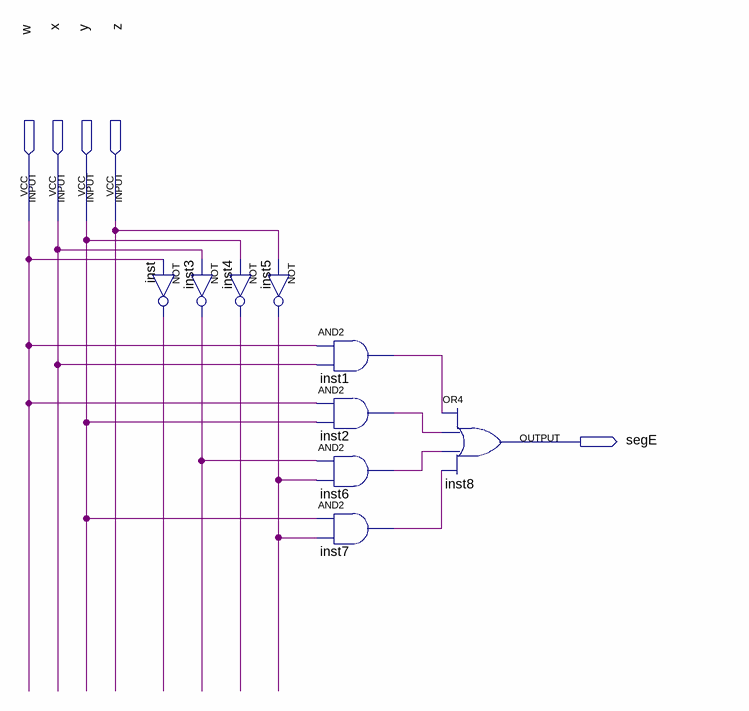
[diagram p0: schematic sheet]
// Quartus schematic segE.bdf as structural Verilog: 9 symbols, 5 pins
module segE (
  input  w,
  input  x,
  input  y,
  input  z,
  output segE
);

  wire inst1_out, inst2_out, inst3_out, inst4_out, inst5_out, inst6_out, inst7_out, inst_out;

  not inst (inst_out, w);
  not inst3 (inst3_out, x);
  not inst4 (inst4_out, y);
  not inst5 (inst5_out, z);
  and inst1 (inst1_out, w, x);
  and inst2 (inst2_out, w, y);
  and inst6 (inst6_out, inst3_out, inst5_out);
  and inst7 (inst7_out, y, inst5_out);
  or inst8 (segE, inst1_out, inst2_out, inst6_out, inst7_out);
endmodule
